# EAGLE schematic Clock_HW (EAGLE 9.5.1)
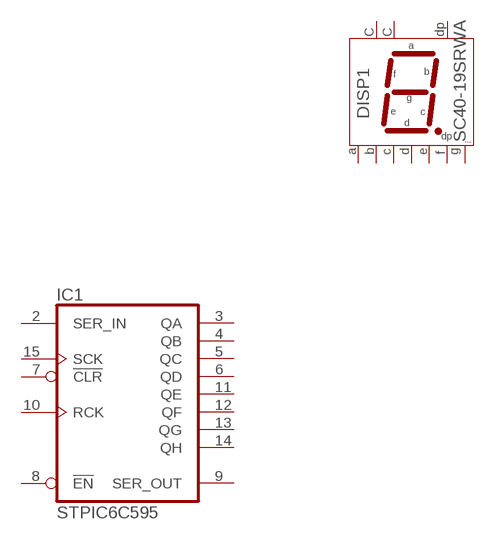
[diagram p0: schematic, sheet 1]

## Parts
DISP1  SC40-19SRWA  [SC40]
IC1  STPIC6C595  [SO16]
Unconnected: DISP1.1(E) DISP1.2(D) DISP1.3(CC1) DISP1.4(C) DISP1.5(DP) DISP1.6(B) DISP1.7(A) DISP1.8(CC2) DISP1.9(F) DISP1.10(G) IC1.2(SER_IN) IC1.3(QA) IC1.4(QB) IC1.5(QC) IC1.6(QD) IC1.7(!CLR) IC1.8(!EN) IC1.9(SER_OUT) IC1.10(RCK) IC1.11(QE) IC1.12(QF) IC1.13(QG) IC1.14(QH) IC1.15(SCK)

## Power pins joined to a net without a drawn wire
GND: IC1.16(GND)
VCC: IC1.1(VCC)

## Library data of the parts
DISP1 = #PaJa_displeje:SC40-19SRWA: LED displej 101,2 mm spol.katoda
IC1 = st-microelectronics:STPIC6C595: 8-bit shift register with open drain output (100mA/channel)